# EAGLE design Vumetro (EAGLE 8.0.0)
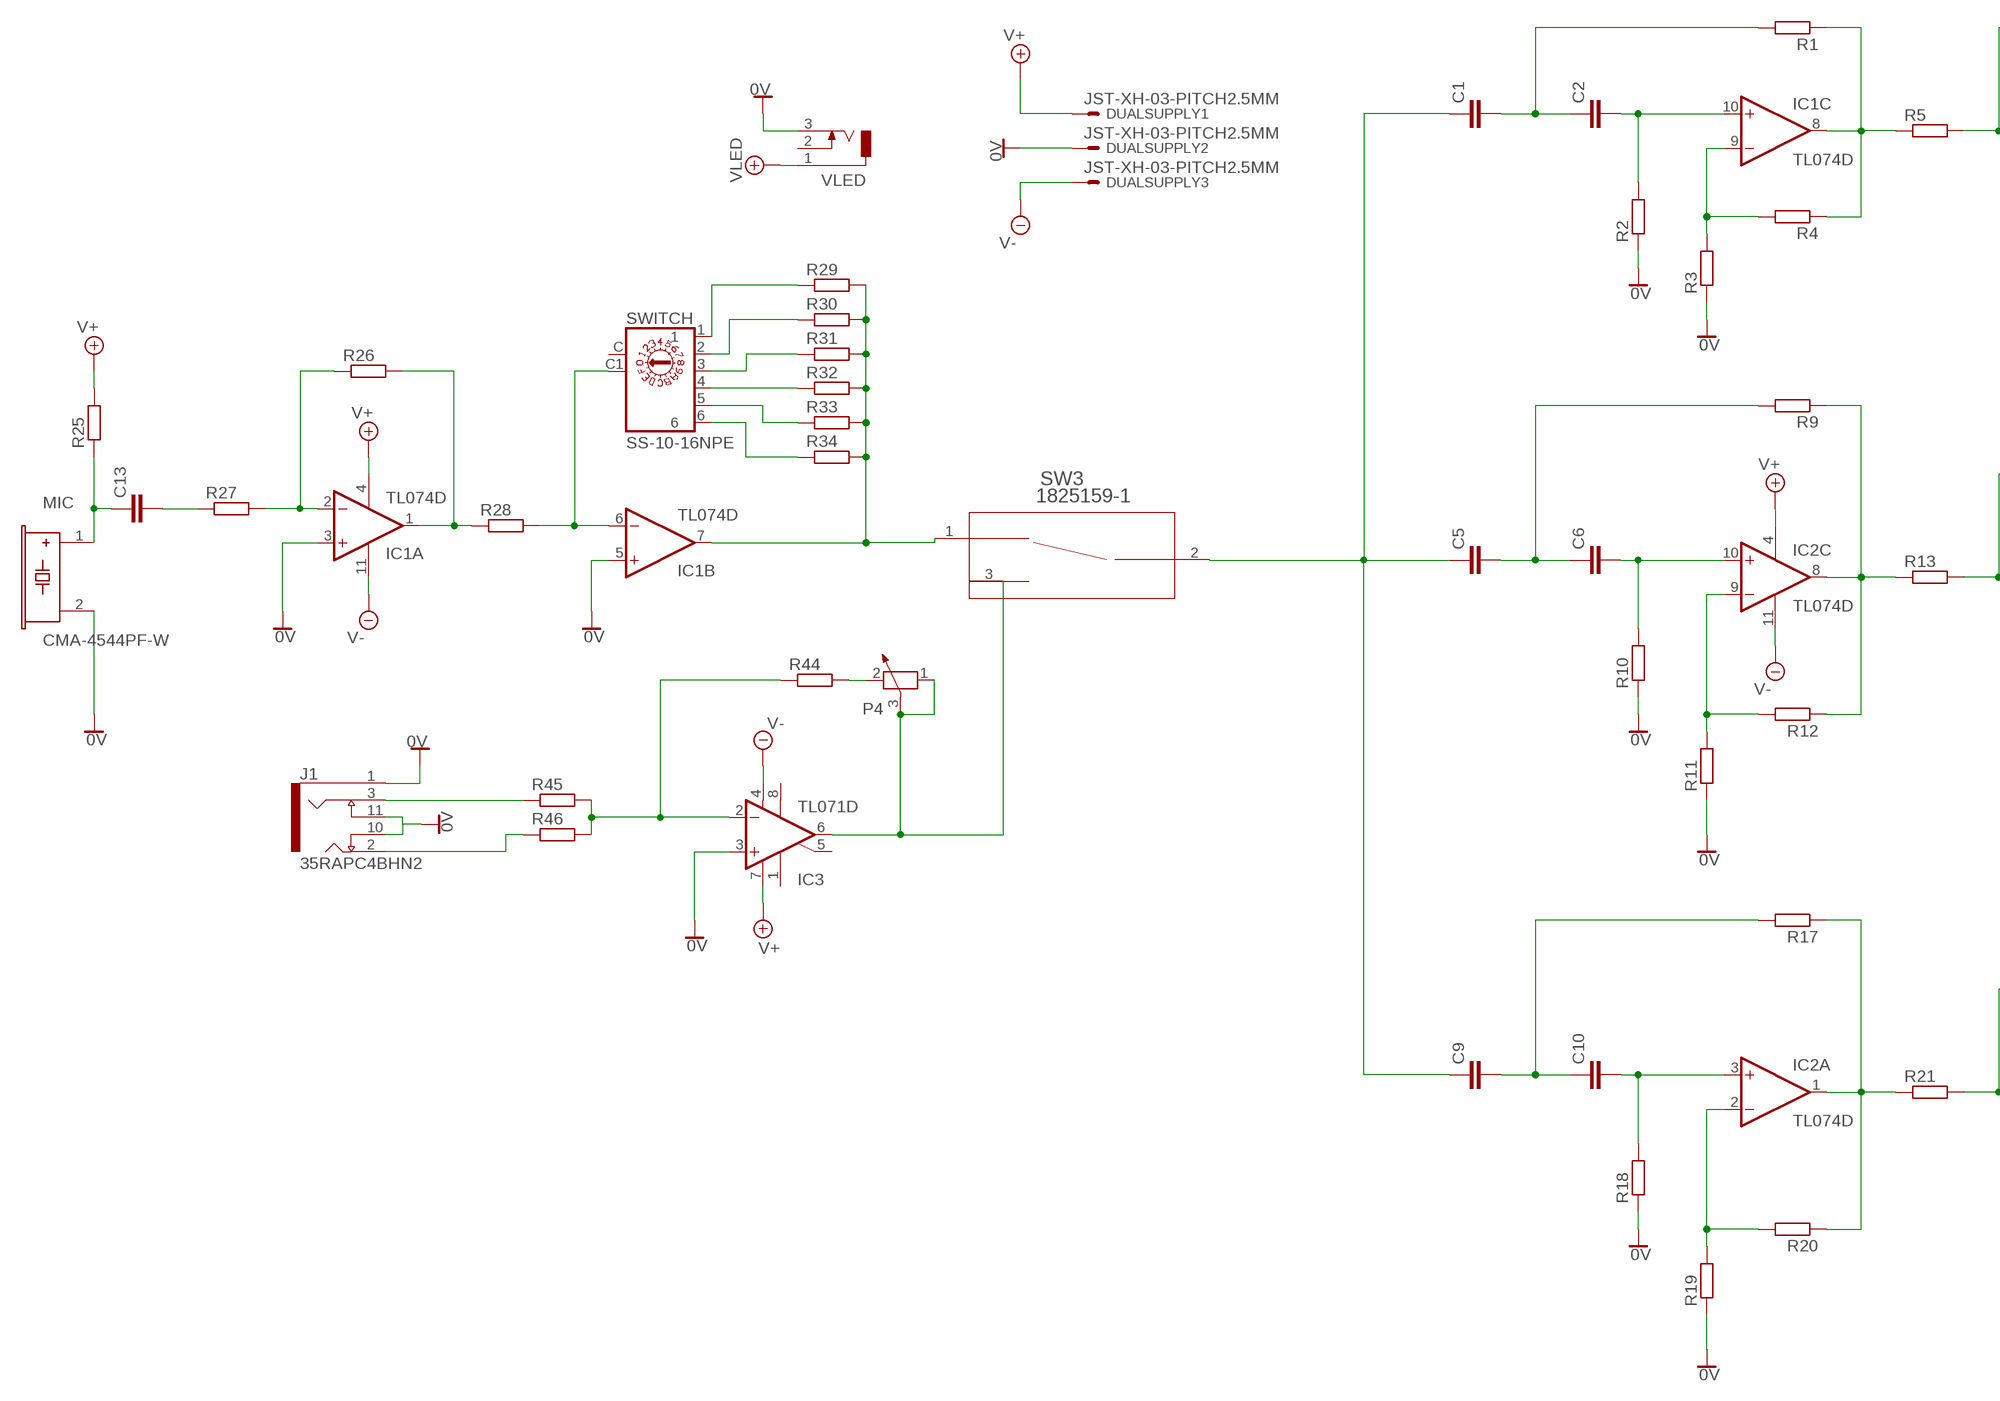
[diagram p0: schematic, sheet 1, part 1 of 2]
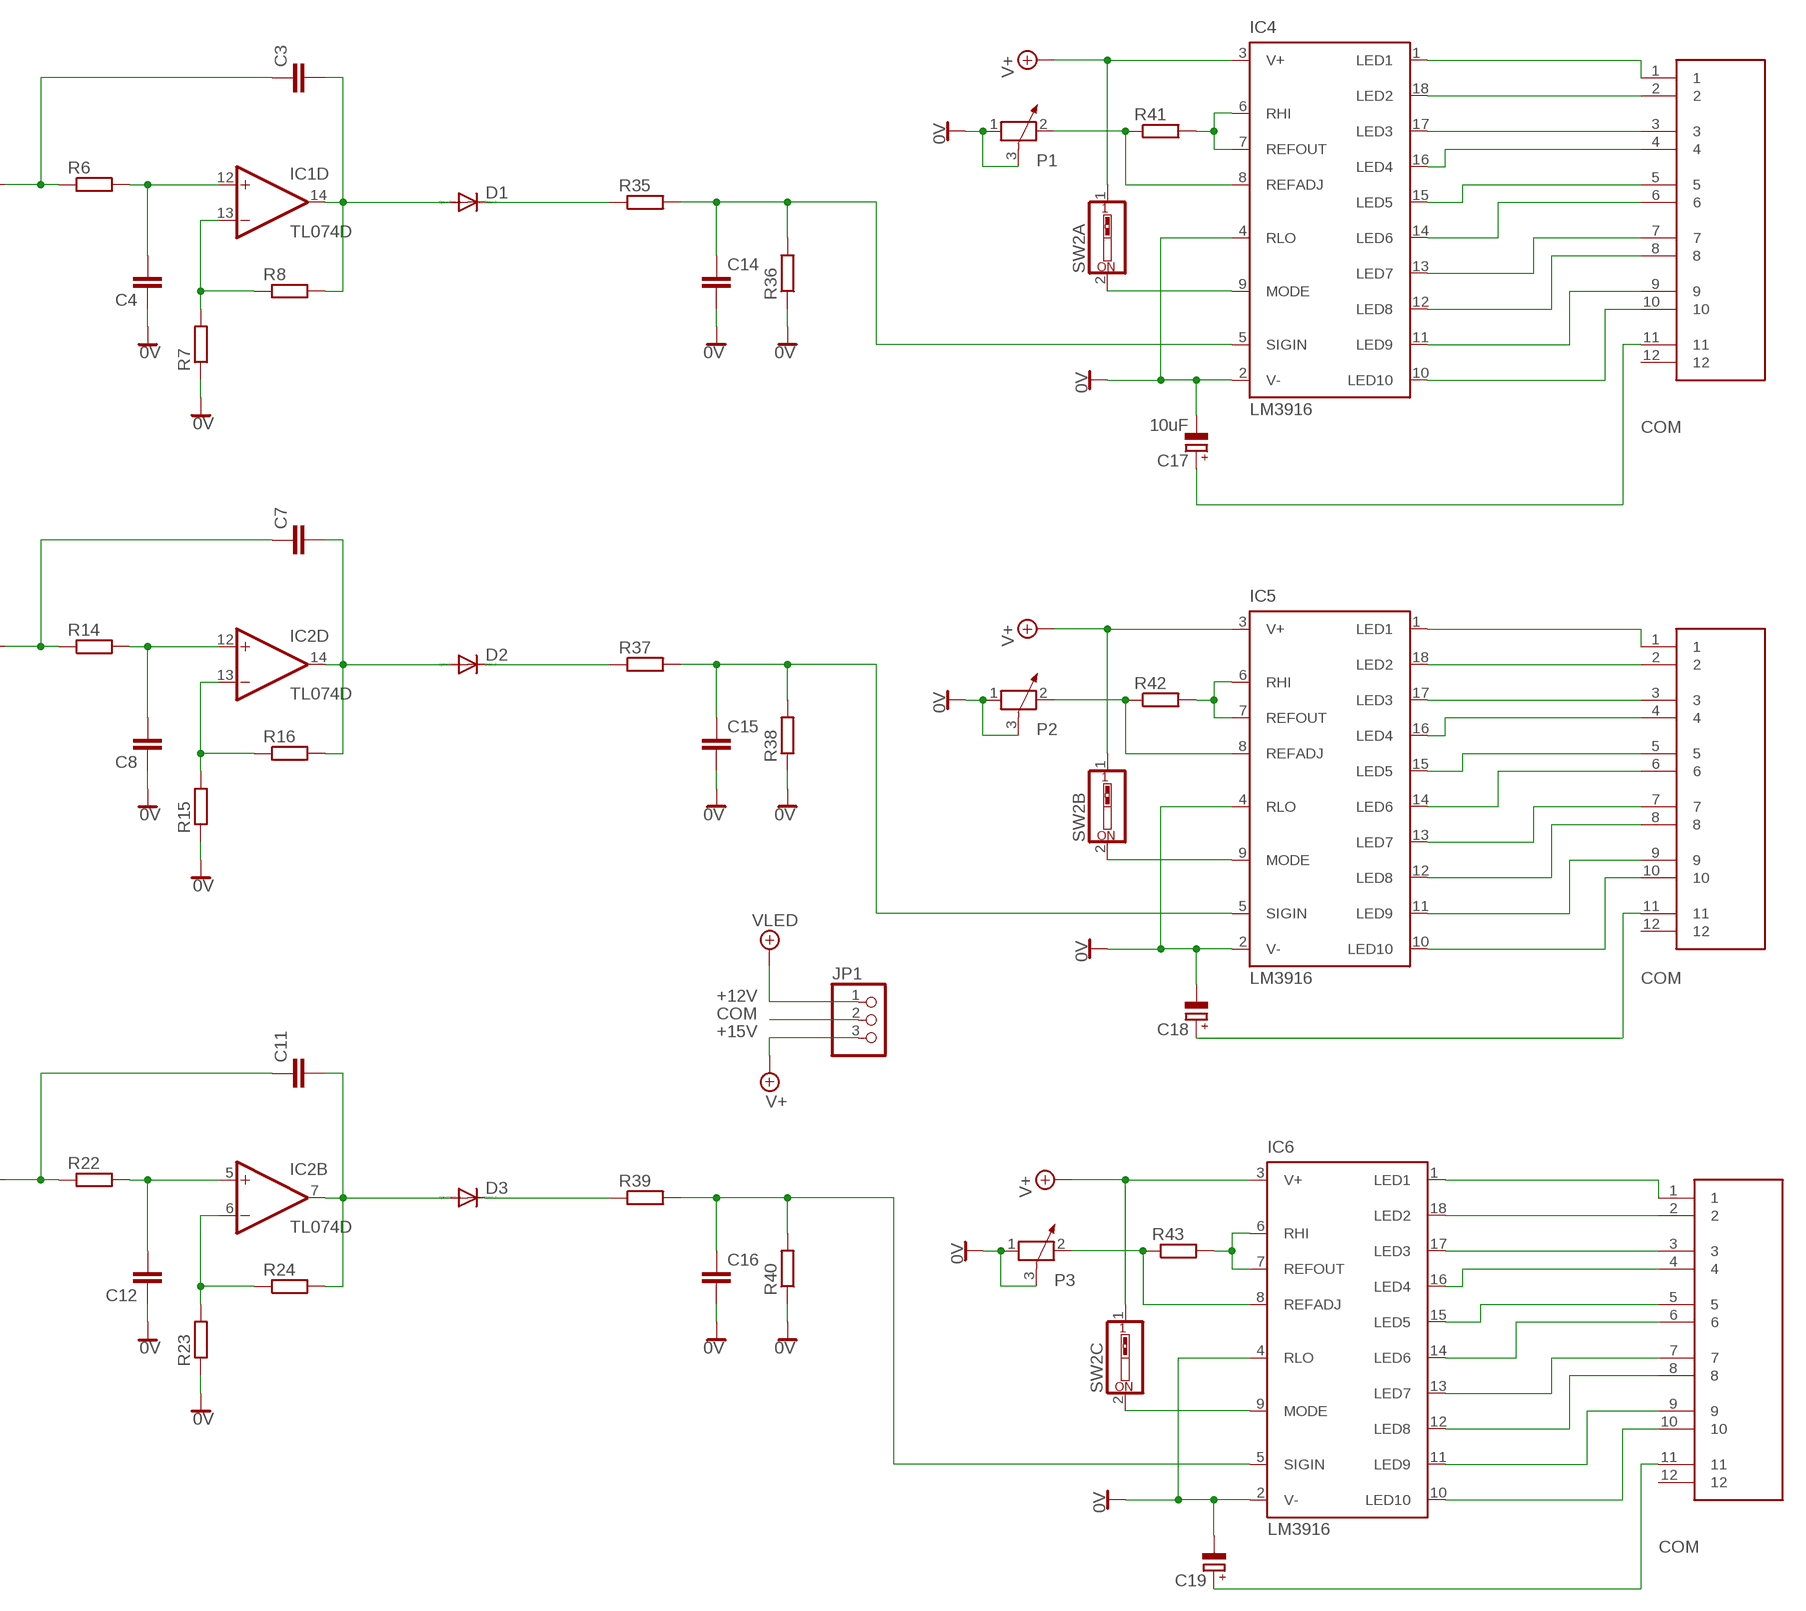
[diagram p1: schematic, sheet 1, part 2 of 2]

## Parts
C1  C-EUC2012  [C2012]
C2  C-EUC2012  [C2012]
C3  C-EUC2012  [C2012]
C4  C-EUC2012  [C2012]
C5  C-EUC2012  [C2012]
C6  C-EUC2012  [C2012]
C7  C-EUC2012  [C2012]
C8  C-EUC2012  [C2012]
C9  C-EUC2012  [C2012]
C10  C-EUC2012  [C2012]
C11  C-EUC2012  [C2012]
C12  C-EUC2012  [C2012]
C13  C-EUC2012  [C2012]
C14  C-EUC2012  [C2012]
C15  C-EUC2012  [C2012]
C16  C-EUC2012  [C2012]
C17  10uF  CPOL-EUE2-4  [E2-4]
C18  CPOL-EUE2-4  [E2-4]
C19  CPOL-EUE2-4  [E2-4]
CON1  DF11-12DP-DIL  [CON_12_2X6_DIL_DF11]
CON2  DF11-12DP-DIL  [CON_12_2X6_DIL_DF11]
CON3  DF11-12DP-DIL  [CON_12_2X6_DIL_DF11]
D1  DIODE-SOD323-W  [SOD323-W]
D2  DIODE-SOD323-W  [SOD323-W]
D3  DIODE-SOD323-W  [SOD323-W]
DUALSUPPLY  JST-XH-03-PITCH2.5MM  [JST-XH-03-PITCH2.5MM]
IC1  TL074D  [SO14]
IC2  TL074D  [SO14]
IC3  TL071D  [SO08]
IC4  LM3916  [DIL18]
IC5  LM3916  [DIL18]
IC6  LM3916  [DIL18]
J1  35RAPC4BHN2  [SWITCHCRAFT_35RAPC4BHN2]
JP1  PINHD-1X3  [1X03]
MIC  CMA-4544PF-W  [CMA-4544PF-W]
P1  POTENTIOMETER_P090  [P090]
P2  POTENTIOMETER_P090  [P090]
P3  POTENTIOMETER_P090  [P090]
P4  POTENTIOMETER_P090  [P090]
R1  R-EU_R0805  [R0805]
R2  R-EU_R0805  [R0805]
R3  R-EU_R0805  [R0805]
R4  R-EU_R0805  [R0805]
R5  R-EU_R0805  [R0805]
R6  R-EU_R0805  [R0805]
R7  R-EU_R0805  [R0805]
R8  R-EU_R0805  [R0805]
R9  R-EU_R0805  [R0805]
R10  R-EU_R0805  [R0805]
R11  R-EU_R0805  [R0805]
R12  R-EU_R0805  [R0805]
R13  R-EU_R0805  [R0805]
R14  R-EU_R0805  [R0805]
R15  R-EU_R0805  [R0805]
R16  R-EU_R0805  [R0805]
R17  R-EU_M0805  [M0805]
R18  R-EU_M0805  [M0805]
R19  R-EU_M0805  [M0805]
R20  R-EU_M0805  [M0805]
R21  R-EU_M0805  [M0805]
R22  R-EU_M0805  [M0805]
R23  R-EU_M0805  [M0805]
R24  R-EU_M0805  [M0805]
R25  R-EU_R0805  [R0805]
R26  R-EU_R0805  [R0805]
R27  R-EU_R0805  [R0805]
R28  R-EU_R0805  [R0805]
R29  R-EU_R0805  [R0805]
R30  R-EU_R0805  [R0805]
R31  R-EU_R0805  [R0805]
R32  R-EU_R0805  [R0805]
R33  R-EU_R0805  [R0805]
R34  R-EU_R0805  [R0805]
R35  R-EU_R0805  [R0805]
R36  R-EU_R0805  [R0805]
R37  R-EU_R0805  [R0805]
R38  R-EU_R0805  [R0805]
R39  R-EU_R0805  [R0805]
R40  R-EU_R0805  [R0805]
R41  R-EU_M0805  [M0805]
R42  R-EU_M0805  [M0805]
R43  R-EU_M0805  [M0805]
R44  R-EU_R0805  [R0805]
R45  R-EU_R0805  [R0805]
R46  R-EU_R0805  [R0805]
SW2A  SW_DIP-1  [EDG-01]
SW2B  SW_DIP-1  [EDG-01]
SW2C  SW_DIP-1  [EDG-01]
SW3  1825159-1  [SW3-SLIDE-2POL_P98]
SWITCH  SS-10-16NPE  [P106]
VLED  DCJ0303  [DCJ0303]

## Nets
0V: C4.1 C8.1 C12.1 C14.2 C15.2 C16.2 C17.- C18.- C19.- DUALSUPPLY.2 IC1.3(A:+IN) IC1.5(B:+IN) IC3.3(+IN) IC4.2(V-) IC4.4(RLO) IC5.2(V-) IC5.4(RLO) IC6.2(V-) IC6.4(RLO) J1.1(SLEEVE) J1.10(TSH) J1.11(RSH) MIC.2(NEG) P1.1 P1.3 P2.1 P2.3 P3.1 P3.3 R2.1 R3.1 R7.1 R10.1 R11.1 R15.1 R18.1 R19.1 R23.1 R36.1 R38.1 R40.1 VLED.3
+12V: JP1.1 VLED.1 ; supply symbol labelled VLED
+15V: DUALSUPPLY.1 IC1.4(P:V+) IC2.4(P:V+) IC3.7(V+) IC4.3(V+) IC5.3(V+) IC6.3(V+) JP1.3 R25.2 SW2A.1 SW2B.1 SW2C.1 ; supply symbol labelled V+
-15V: DUALSUPPLY.3 IC1.11(P:V-) IC2.11(P:V-) IC3.4(V-) ; supply symbol labelled V-
COM: C17.+ C18.+ C19.+ CON1.11 CON2.11 CON3.11 JP1.2
N$1: IC1.7(B:OUT) R29.2 R30.2 R31.2 R32.2 R33.2 R34.2 SW3.1
N$2: R29.1 SWITCH.1
N$3: R30.1 SWITCH.2
N$4: R31.1 SWITCH.3
N$5: R32.1 SWITCH.4
N$6: R33.1 SWITCH.5
N$7: R34.1 SWITCH.6
N$8: IC1.2(A:-IN) R26.1 R27.2
N$9: IC1.6(B:-IN) R28.2 SWITCH.C1
N$10: IC1.1(A:OUT) R26.2 R28.1
N$11: IC3.2(-IN) R44.1 R45.2 R46.2
N$12: P4.2 R44.2
N$13: IC3.6(OUT) P4.1 P4.3 SW3.3
N$14: J1.3(RING) R45.1
N$15: J1.2(TIP) R46.1
N$16: C1.2 C2.1 R1.2
N$17: C2.2 IC1.10(C:+IN) R2.2
N$18: IC1.9(C:-IN) R3.2 R4.2
N$19: IC1.8(C:OUT) R1.1 R4.1 R5.1
N$20: IC1.13(D:-IN) R7.2 R8.1
N$21: C3.2 D1.A IC1.14(D:OUT) R8.2
N$22: C4.2 IC1.12(D:+IN) R6.2
N$23: C3.1 R5.2 R6.1
N$24: C5.2 C6.1 R9.2
N$25: C6.2 IC2.10(C:+IN) R10.2
N$26: IC2.9(C:-IN) R11.2 R12.2
N$27: IC2.8(C:OUT) R9.1 R12.1 R13.1
N$28: IC2.13(D:-IN) R15.2 R16.1
N$29: C7.2 D2.A IC2.14(D:OUT) R16.2
N$30: C8.2 IC2.12(D:+IN) R14.2
N$31: C7.1 R13.2 R14.1
N$32: C9.2 C10.1 R17.2
N$33: C10.2 IC2.3(A:+IN) R18.2
N$34: IC2.2(A:-IN) R19.2 R20.2
N$35: IC2.1(A:OUT) R17.1 R20.1 R21.1
N$36: IC2.6(B:-IN) R23.2 R24.1
N$37: C11.2 D3.A IC2.7(B:OUT) R24.2
N$38: C12.2 IC2.5(B:+IN) R22.2
N$39: C11.1 R21.2 R22.1
N$40: C1.1 C5.1 C9.1 SW3.2
N$41: D1.C R35.1
N$42: C14.1 IC4.5(SIGIN) R35.2 R36.2
N$43: D2.C R37.1
N$44: C15.1 IC5.5(SIGIN) R37.2 R38.2
N$45: D3.C R39.1
N$46: C16.1 IC6.5(SIGIN) R39.2 R40.2
N$47: C13.2 R27.1
N$48: IC4.9(MODE) SW2A.2
N$49: IC4.6(RHI) IC4.7(REFOUT) R41.2
N$50: IC4.8(REFADJ) P1.2 R41.1
N$51: C13.1 MIC.1(POS) R25.1
N$52: CON1.1 IC4.1(LED1)
N$53: CON1.2 IC4.18(LED2)
N$54: CON1.3 IC4.17(LED3)
N$55: CON1.4 IC4.16(LED4)
N$56: CON1.5 IC4.15(LED5)
N$57: CON1.6 IC4.14(LED6)
N$58: CON1.7 IC4.13(LED7)
N$59: CON1.8 IC4.12(LED8)
N$60: CON1.9 IC4.11(LED9)
N$61: CON1.10 IC4.10(LED10)
N$63: IC5.9(MODE) SW2B.2
N$64: IC5.6(RHI) IC5.7(REFOUT) R42.2
N$65: IC5.8(REFADJ) P2.2 R42.1
N$66: CON2.1 IC5.1(LED1)
N$67: CON2.2 IC5.18(LED2)
N$68: CON2.3 IC5.17(LED3)
N$69: CON2.4 IC5.16(LED4)
N$70: CON2.5 IC5.15(LED5)
N$71: CON2.6 IC5.14(LED6)
N$72: CON2.7 IC5.13(LED7)
N$73: CON2.8 IC5.12(LED8)
N$74: CON2.9 IC5.11(LED9)
N$75: CON2.10 IC5.10(LED10)
N$77: IC6.9(MODE) SW2C.2
N$78: IC6.6(RHI) IC6.7(REFOUT) R43.2
N$79: IC6.8(REFADJ) P3.2 R43.1
N$80: CON3.1 IC6.1(LED1)
N$81: CON3.2 IC6.18(LED2)
N$82: CON3.3 IC6.17(LED3)
N$83: CON3.4 IC6.16(LED4)
N$84: CON3.5 IC6.15(LED5)
N$85: CON3.6 IC6.14(LED6)
N$86: CON3.7 IC6.13(LED7)
N$87: CON3.8 IC6.12(LED8)
N$88: CON3.9 IC6.11(LED9)
N$89: CON3.10 IC6.10(LED10)
Unconnected: CON1.12 CON2.12 CON3.12 IC3.1(ON1) IC3.5(ON2) IC3.8(OPT) SWITCH.C VLED.2

## Library data of the parts
C1-C16 = rcl:C-EU: CAPACITOR, European symbol
C17-C19 = rcl:CPOL-EU: POLARIZED CAPACITOR, European symbol
CON1-CON3 = con-hirose:DF11-12DP-DIL
D1-D3 = diode:DIODE-: DIODE
DUALSUPPLY = Rembrandt Electronics - JST XH Connectors v1-0:JST-XH-03-PITCH2.5MM
IC1 IC2 = linear:TL074: OP AMP
IC3 = linear:TL071: OP AMP
IC4-IC6 = national-semiconductor:LM3916
J1 = mini jack:35RAPC4BHN2: Conn 3.5MM Stereo Jack F 5 POS Solder RA Thru-Hole 5 Terminal 1 Port; DESCRIPTION: Conn 3.5MM Stereo Jack F 5 POS Solder RA Thru-Hole 5 Terminal 1 Port; DIGI-KEY_PART_NUMBER: SC1459-ND; DIGI-KEY_PURCHASE_URL: https://www.digikey.es/product-detail/en/switchcraft-inc/35RAPC4BHN2/SC1459-ND/1288690?WT.z_cid=ref_snapeda&utm_source=snapeda&utm_medium=aggregator&utm_campaign=buynow; MF: Switchcraft; MP: 35RAPC4BHN2; PACKAGE: None
JP1 = pinhead:PINHD-1X3: PIN HEADER
MIC = Electret:CMA-4544PF-W; DESCRIPTION: CMA Series 9.7 mm Electret Condenser Omni-Directional Pin Mount 3 V Microphone; DIGI-KEY_PART_NUMBER: 102-1721-ND; DIGI-KEY_PURCHASE_URL: https://www.digikey.es/product-detail/en/cui-inc/CMA-4544PF-W/102-1721-ND/1869981?WT.z_cid=ref_snapeda&utm_source=snapeda&utm_medium=aggregator&utm_campaign=buynow; MF: CUI; MP: CMA-4544PF-W; PACKAGE: 6-DIP-6 CUI
P1-P4 = rcl:POTENTIOMETER_: Potentiometer
R1-R46 = rcl:R-EU_: RESISTOR, European symbol
SW2A SW2B SW2C = special:SW_DIP-1: DIP SWITCH
SW3 = switch:1825159-1; MANUFACTURER_PART_NUMBER: 18251591; VENDOR: TE Connectivity
SWITCH = switch-dil:SS-10-16NPE
VLED = con-jack:DCJ0303: DC POWER JACK Source: DCJ0303.pdf; OC_FARNELL: unknown; OC_NEWARK: unknown

## Board
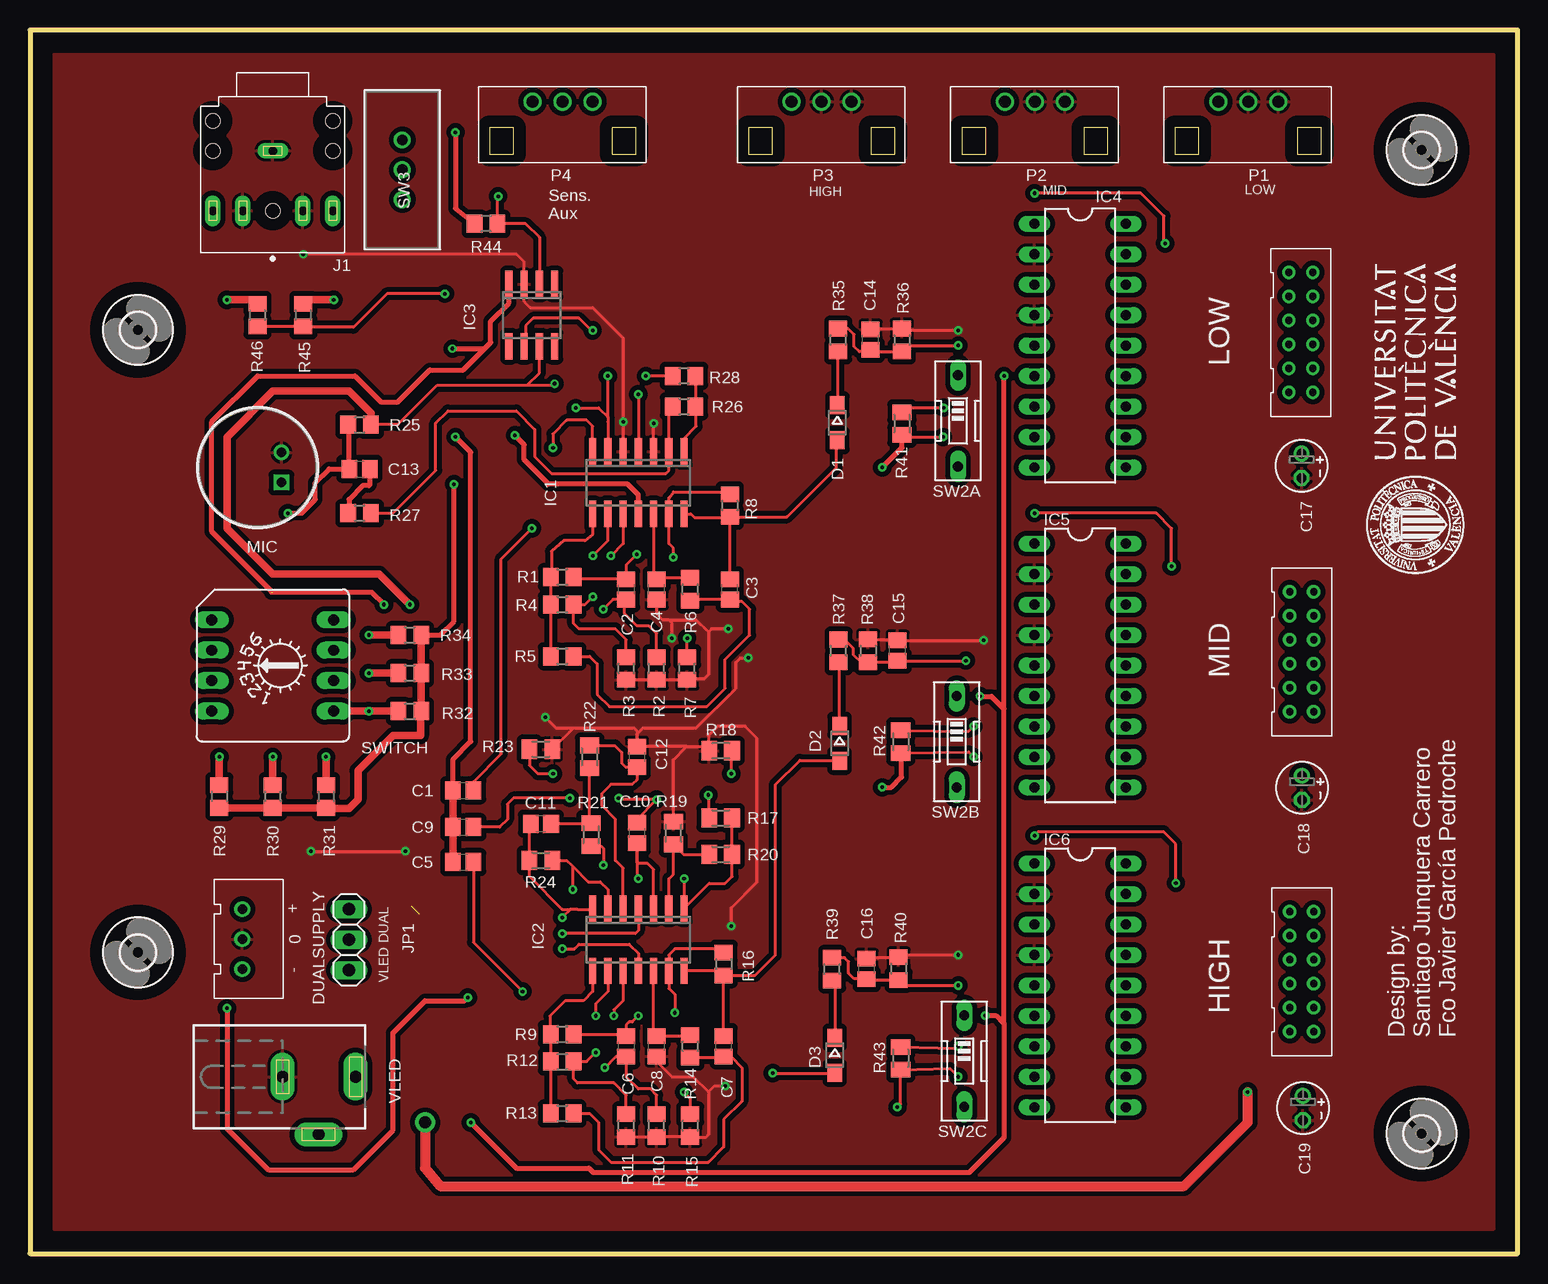
[diagram p2: board, top side]
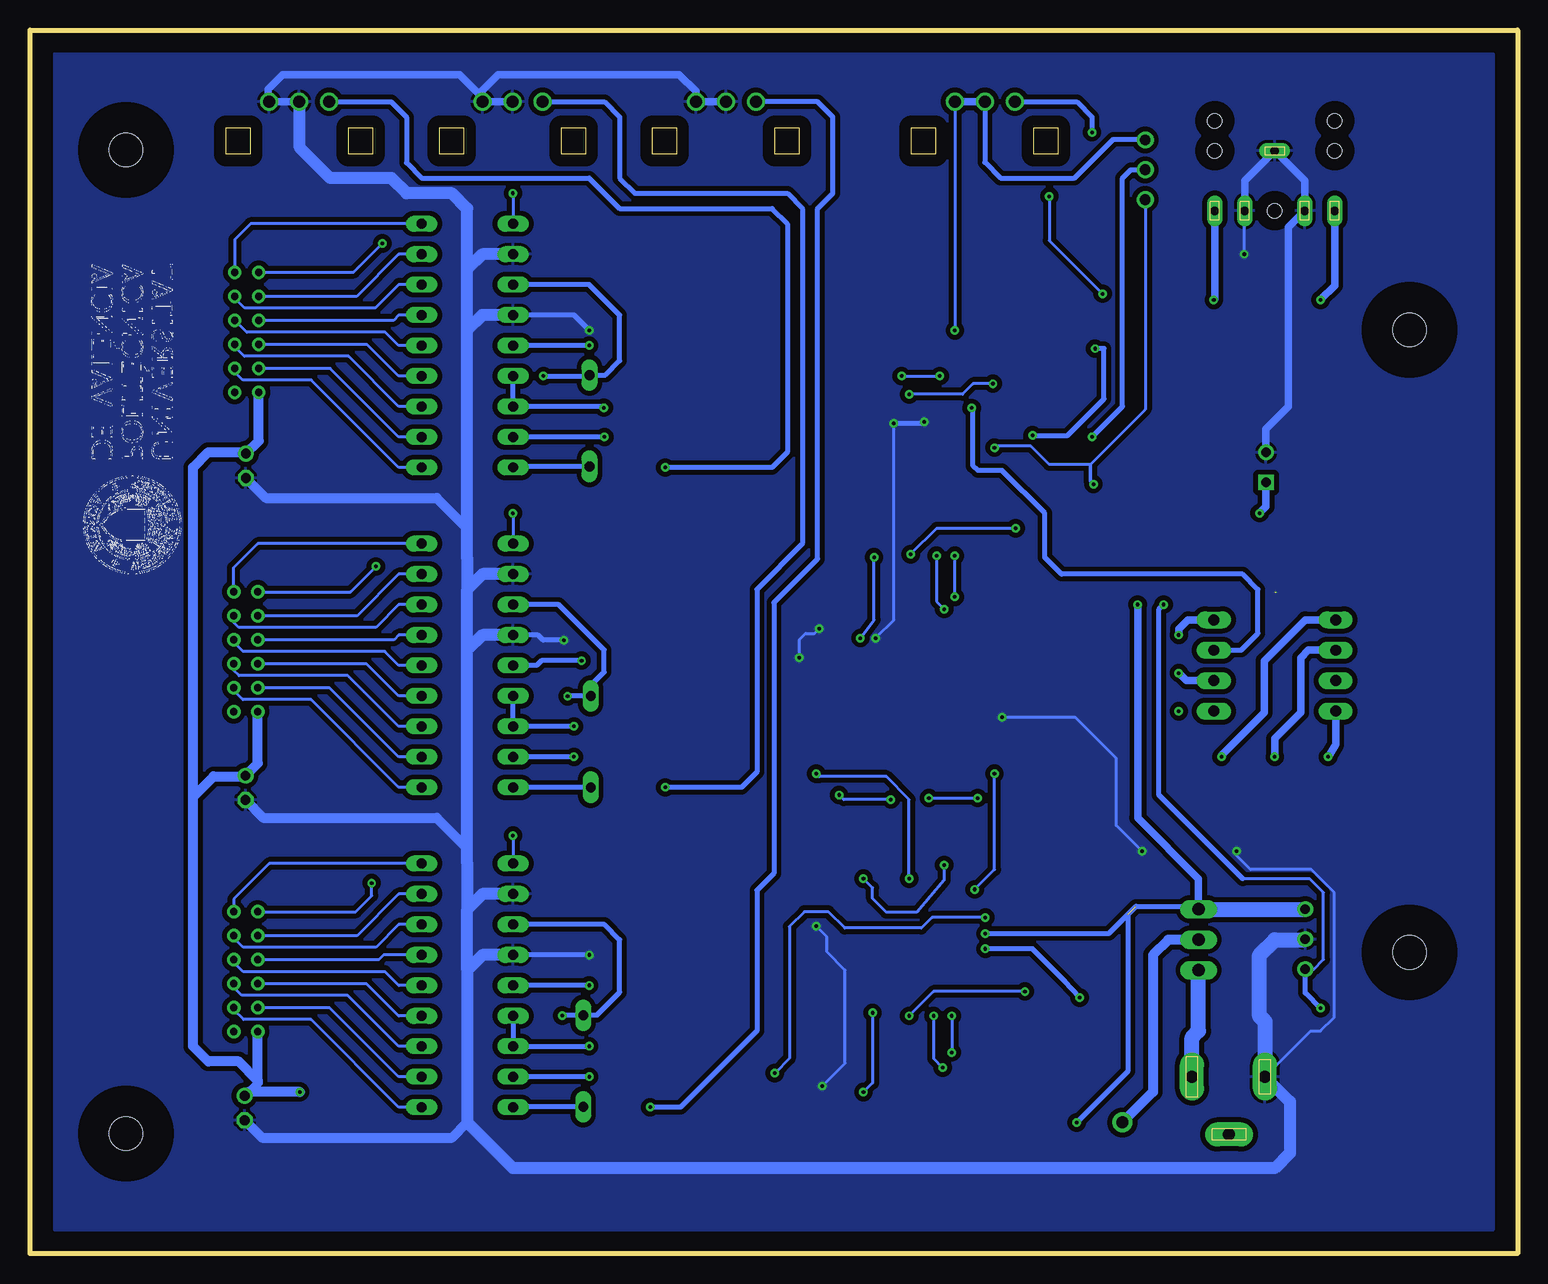
[diagram p3: board, bottom side, seen from below]

Size 124 x 102 mm. Coordinates in mm from the lower left corner, seen from the top.
Outline: 0,0 124,0 124,102 0,102 0,0
Copper layers (1*16): Top 0.035mm / dielectric 1.5mm / Bottom 0.035mm
Design rules "default *": minimum track width 6mil, minimum drill 0.3mm, track to track 6mil, track to pad 6mil, pad to pad 6mil, via to via 6mil, smd to smd 4mil, copper to edge 40mil, drill to drill 8mil, minimum pad ring 10mil, minimum via ring 8mil, stop-mask expansion 4mil, vias tented up to drill 0mil, thermal gap 10mil

### Footprints (pad centres in the part's own frame; a part is rotated, then mirrored left to right if it is on the bottom)
C2012 = smd 1.3 x 1.5: 1 -0.85,0; 2 0.85,0
E2-4 = drill 0.813 pad 1.27: + -1.016,0 | drill 0.813 pad 1.27 octagon: - 1.016,0
CON_12_2X6_DIL_DF11 = drill 0.6: 1 -4.953,-1.016; 2 -4.953,0.984; 3 -2.953,-1.016; 4 -2.953,0.984; 5 -0.953,-1.016; 6 -0.953,0.984; 7 1.047,-1.016; 8 1.047,0.984; 9 3.047,-1.016; 10 3.047,0.984; 11 5.047,-1.016; 12 5.047,0.984
SOD323-W = smd 1.5 x 1.2: A 1.45,0; C -1.45,0
JST-XH-03-PITCH2.5MM = drill 0.8: 1 -2.54,-1.27; 2 -0.04,-1.27; 3 2.46,-1.27
SO14 = smd 0.6 x 2.2: 1 -3.81,-2.6; 2 -2.54,-2.6; 3 -1.27,-2.6; 4 0,-2.6; 5 1.27,-2.6; 6 2.54,-2.6; 7 3.81,-2.6; 8 3.81,2.6; 9 2.54,2.6; 10 1.27,2.6; 11 0,2.6; 12 -1.27,2.6; 13 -2.54,2.6; 14 -3.81,2.6
SO08 = smd 0.6 x 2.2: 1 -1.905,-2.6; 2 -0.635,-2.6; 3 0.635,-2.6; 4 1.905,-2.6; 5 1.905,2.6; 6 0.635,2.6; 7 -0.635,2.6; 8 -1.905,2.6
DIL18 = drill 0.813 long: 1 -10.16,-3.81; 2 -7.62,-3.81; 3 -5.08,-3.81; 4 -2.54,-3.81; 5 0,-3.81; 6 2.54,-3.81; 7 5.08,-3.81; 8 7.62,-3.81; 9 10.16,-3.81; 10 10.16,3.81; 11 7.62,3.81; 12 5.08,3.81; 13 2.54,3.81; 14 0,3.81; 15 -2.54,3.81; 16 -5.08,3.81; 17 -7.62,3.81; 18 -10.16,3.81
SWITCHCRAFT_35RAPC4BHN2 = drill 0.7 pad 1.3 long: 1 0,-1; 2 5,4; 3 -5,4; 10 2.5,4; 11 -2.5,4 | hole 1.2: 0,4; -5,-1; -5,-3.5; 5,-1; 5,-3.5
1X03 = drill 1.016 long: 1 -2.54,0; 2 0,0; 3 2.54,0
CMA-4544PF-W = drill 0.8 square: 1 2,-1.25 | drill 0.8: 2 2,1.25
P090 = drill 1: 1 0,0; 2 5,0; 3 2.5,0
R0805 = smd 1.3 x 1.5: 1 -0.95,0; 2 0.95,0
M0805 = smd 1.3 x 1.6: 1 -0.95,0; 2 0.95,0
EDG-01 = drill 0.813 long: 1 0,-3.81; 2 0,3.81
SW3-SLIDE-2POL_P98 = drill 0.889 pad 1.397: 1 -4.978,0; 2 -2.489,0; 3 0,0
P106 = drill 0.914 long: 1 6.35,5.08; 2 6.35,0; 3 6.35,-2.54; 4 -3.81,5.08; 5 -3.81,2.54; 6 -3.81,-2.54; C 6.35,2.54; C1 -3.81,0
2,8 = hole 2.8: 0,0
DCJ0303 = drill 1 pad 2 long: 1 0,3.1; 2 4.8,0; 3 0,-3

### Placement (x,y rotation side)
C1  36.11,38.61 0 top
C2  49.7,55.37 270 top
C3  58.33,55.37 90 top
C4  52.24,55.37 90 top
C5  36.11,32.64 0 top
C6  49.7,17.27 270 top
C7  57.83,17.27 90 top
C8  52.24,17.27 90 top
C9  36.11,35.56 0 top
C10  50.59,35.05 270 top
C11  42.59,35.81 180 top
C12  50.59,41.4 270 top
C13  27.47,65.4 0 top
C14  70.07,76.18 90 top
C15  72.31,50.26 90 top
C16  69.74,23.72 90 top
C17  106,65.66 270 top
C18  106.03,38.82 270 top
C19  106.11,12.13 270 top
CON1  105.95,76.84 270 top
CON2  106.02,50.21 270 top
CON3  106.02,23.54 270 top
D1  67.3,69.26 270 top
D2  67.49,42.53 270 top
D3  67.08,16.53 270 top
DUALSUPPLY  18.96,26.16 270 top
IC1  50.71,64.26 180 top
IC2  50.71,26.16 180 top
IC3  41.82,78.23 180 top
IC4  87.54,75.69 270 top
IC5  87.54,49.02 270 top
IC6  87.54,22.35 270 top
J1  20.23,90.93 180 top
JP1  26.58,26.16 90 top
MIC  18.96,65.53 0 top
P1  104.05,96.01 180 top
P2  86.27,96.01 180 top
P3  68.49,96.01 180 top
P4  46.9,96.01 180 top
R1  44.36,56.39 0 top
R2  52.24,48.77 90 top
R3  49.7,48.77 90 top
R4  44.36,54.1 0 top
R5  44.36,49.78 0 top
R6  55.03,55.37 90 top
R7  54.78,48.77 90 top
R8  58.33,62.36 270 top
R9  44.36,18.29 0 top
R10  52.24,10.67 90 top
R11  49.7,10.67 90 top
R12  44.36,16 0 top
R13  44.36,11.68 0 top
R14  55.03,17.27 90 top
R15  55.03,10.67 90 top
R16  57.83,24.13 270 top
R17  57.57,36.32 180 top
R18  57.57,41.91 0 top
R19  53.64,35.05 270 top
R20  57.57,33.27 180 top
R21  46.78,34.92 90 top
R22  46.65,41.4 90 top
R23  42.59,42.04 180 top
R24  42.59,32.77 180 top
R25  27.47,69.09 0 top
R26  54.52,70.61 0 top
R27  27.47,61.72 0 top
R28  54.52,73.15 180 top
R29  15.79,38.1 270 top
R30  20.23,38.1 270 top
R31  24.68,38.1 270 top
R32  31.66,45.21 0 top
R33  31.66,48.39 0 top
R34  31.66,51.56 0 top
R35  67.37,76.15 90 top
R36  72.68,76.15 270 top
R37  67.4,50.24 90 top
R38  69.87,50.25 270 top
R39  66.86,23.71 90 top
R40  72.41,23.75 270 top
R41  72.69,69.19 90 top
R42  72.58,42.67 90 top
R43  72.58,16.27 90 top
R44  38.01,85.85 180 top
R45  22.77,78.23 270 top
R46  18.96,78.23 270 top
SW2A  77.36,69.42 180 top
SW2B  77.26,42.67 180 top
SW2C  77.88,16.05 180 top
SW3  31.03,92.84 90 top
SWITCH  21.5,50.29 180 top
U$1  [LOGOUPVTOP]  120.86,54.33 90 top
U$4  [2,8]  9,77 0 top
U$5  [2,8]  116,92 0 top
U$6  [2,8]  116,10 0 top
U$7  [2,8]  9,25.1 0 top
VLED  24.04,14.73 270 top

### Tracks (layer width: path | path; a pad name or v marks a point on that pad's centre or on a via)
0V  (via drill 0.3 pad 0.51)
  Top 0.254: R11.1 R10.1 R15.1 55.1,9.65 56.3,9.65 56.56,9.91 56.56,13.46 | C8.1 52.24,16 53.51,14.73 55.29,14.73 56.56,13.46 | R3.1 R2.1 R7.1 54.84,47.88 56.18,47.88 56.56,48.26 56.56,51.82 | 52.24,54.1 C4.1 52.24,53.34 52.75,52.83 53.25,52.83 | 53.25,52.83 55.54,52.83 56.56,51.82 | R23.1 45.31,43.81 | 45.31,43.81 50.33,43.81 50.59,43.56 C12.1 | R18.1 56.28,42.25 54.74,42.25 | 54.74,42.25 C12.1 | R19.1 53.64,41.15 54.74,42.25 | IC1.5 v49.44,69.34 49.44,76.33 46.91,78.87 41.7,78.87 41.19,79.38 IC3.3 41.19,82.68 40.55,83.31 v22.77,83.31 | IC1.3 v51.98,69.22 | v53.51,51.31 53.51,52.58 53.25,52.83 | C12.1 50.59,43.31 51.1,43.81 55.54,43.81 58.84,47.12 58.84,49.28 59.22,49.66 v59.86,49.66 | v58.21,52.07 56.81,52.07 56.56,51.82 | v23.41,33.53 v31.28,33.53 | v42.97,44.7 43.86,43.81 45.31,43.81 | 56.56,13.46 57.06,13.97 v57.95,13.97 | v58.46,27.3 58.46,28.83 60.62,30.99 60.62,42.93 59.61,43.94 57.32,43.94 56.56,43.18 56.56,41.98 R18.1 | R18.1 56.62,41.84 57.06,41.4 | R38.1 72.23,51.2 C15.2 79.47,51.11 v79.49,51.13 | C14.2 70.14,77.1 R36.1 72.82,76.96 v77.39,76.96 | C16.2 69.87,24.7 R40.1 72.6,24.89 v77.39,24.89
  Bottom 0.254: v22.77,83.31 22.77,86.89 J1.11 | v53.51,51.31 51.98,52.83 v51.98,69.22 | v59.86,49.66 59.86,51.18 59.35,51.69 58.59,51.69 v58.21,52.07 | VLED.3 17.23,18.54 16.42,18.54 15.28,19.68 15.28,30.1 17.19,32 22.27,32 23.41,33.15 v23.41,33.53 | v31.28,33.53 33.44,35.69 33.44,41.27 36.87,44.7 v42.97,44.7 | v57.95,13.97 56.05,15.88 56.05,23.62 57.57,25.15 57.57,26.42 v58.46,27.3
  Bottom 0.406: v51.98,69.22 49.57,69.22 v49.44,69.34 | v79.49,51.13 81.22,51.13 81.65,51.56 IC5.4 | v77.39,76.96 78.66,78.23 IC4.4 | v77.39,24.89 IC6.4
  Bottom 0.61: J1.11 22.73,89.43 J1.1 17.73,89.43 J1.10 19.09,85.58 19.09,70.61 20.97,68.74 MIC.2 | P3.3 P3.1 68.5,96.88 69.89,98.27 84.98,98.27 86.3,96.95 86.3,96.04 P2.1 | P2.3 P2.1 | P1.3 P1.1 104.13,96.09 104.13,97.08 102.94,98.27 88.2,98.27 86.28,96.34 P2.1
  Bottom 0.813: C19.- 104.65,9.65 88.81,9.65 87.55,10.92 | C18.- 104.55,36.32 90.08,36.32 87.55,33.78 87.55,32.51 | C17.- 104.34,62.99 90.08,62.99 87.55,60.45 87.55,57.91
  Bottom 1.016: VLED.3 18.97,12.65 18.97,8.38 20.23,7.11 83.73,7.11 87.55,10.92 87.55,23.62 | 87.55,76.96 87.55,82.04 | 87.55,55.37 87.55,57.91 87.55,76.96 | 87.55,50.29 87.55,55.37 | 87.55,28.7 87.55,32.51 87.55,50.29 | 87.55,23.62 87.55,28.7 | 87.55,82.04 87.55,87.12 88.81,88.39 92.62,88.39 93.89,89.66 98.97,89.66 101.52,92.2 101.52,95.97 P1.3 | IC4.2 86.28,83.31 87.55,82.04 | IC4.4 86.28,78.23 87.55,76.96 | IC5.2 86.28,56.64 87.55,55.37 | IC5.4 86.28,51.56 87.55,50.29 | IC6.2 86.28,29.97 87.55,28.7 | IC6.4 86.28,24.89 87.55,23.62
  Bottom 1.27: VLED.3 21.05,19.35 21.51,19.81 21.51,24.89 20.23,26.16 17.73,26.16 DUALSUPPLY.2
  pour Top (isolate 0.406): 2,2 2,100 122,100 122,2
  pour Bottom (isolate 0.406): 2,2 2,100 122,100 122,2
+12V
  Bottom 1.27: VLED.1 27.15,17.98 26.59,18.54 JP1.1
+15V  (via drill 0.3 pad 0.51)  (1 unrouted)
  Top 0.254: IC2.4 50.72,26.92 50.46,26.67 v44.37,26.67 | R25.2 30.65,69.09 33.95,72.39 41.44,72.39 | 41.44,72.39 42.46,73.41 IC3.7 | 41.44,72.39 43.6,72.39 v43.73,72.52 | v50.72,71.63 IC1.4
  Top 0.406: v36.74,10.92 40.55,7.11 46.6,7.11 46.96,6.76 78.3,6.76 81.19,9.65 81.19,19.15 | 81.19,19.15 81.19,45.41 | 81.19,45.41 v81.19,73.15 | v79.19,46.46 80.15,46.46 81.19,45.41 | v79.62,19.84 80.51,19.84 81.19,19.15
  Top 0.61: R25.2 28.42,70.04 26.59,71.88 20.23,71.88 16.42,68.07 16.42,60.45 20.23,56.64 29.12,56.64 v31.66,54.1
  Bottom 0.254: v43.73,72.52 45.38,72.52 46.27,71.63 v50.72,71.63 | 77.26,47.35 SW2B.1
  Bottom 0.406: v44.37,26.67 34.08,26.67 31.79,28.96 26.84,28.96 JP1.3 | 77.26,47.35 76.14,48.46 76.14,50.32 79.92,54.1 IC5.3 | IC4.3 77.39,80.77 74.84,78.23 74.84,74.42 76.04,73.23 SW2A.1 77.44,73.15 v81.19,73.15 | IC6.3 76.11,27.43 74.84,26.16 74.84,21.77 76.77,19.86 SW2C.1 79.6,19.86 v79.62,19.84 | 32.49,28.26 32.49,15.18 v36.74,10.92 | v79.19,46.46 79.16,46.48 SW2B.1
  Bottom 0.61: v31.66,54.1 31.66,36.32 26.59,31.24 JP1.3
  Bottom 1.27: JP1.3 DUALSUPPLY.1
-15V  (via drill 0.3 pad 0.51)  (1 unrouted)
  Top 0.254: v44.37,25.4 45.38,25.4 45.76,25.78 49.95,25.78 50.72,25.02 IC2.11
  Top 0.406: v16.42,20.45 16.42,10.41 19.85,6.99 26.97,6.99 30.27,10.29 30.27,18.41 32.94,21.08 36.24,21.08 v36.49,21.34 36.62,21.21 | v29.51,54.1 28.49,55.12 20.11,55.12 | 20.23,55.12 15.16,60.2 15.16,69.34 18.97,73.15 27.09,73.15 29.25,70.99 30.65,70.99 33.32,73.66 36.11,73.66 37.89,75.44 | IC3.4 39.92,79.25 38.4,77.72 38.4,75.95 37.89,75.44 | IC1.11 50.72,63.25 49.83,64.14 43.22,64.14 41.19,66.17 41.19,67.44 v40.43,68.2 | v35.22,75.44 37.89,75.44
  Bottom 0.254: DUALSUPPLY.3 16.98,23.7 16.17,24.51 16.17,30.1 17.31,31.24 22.9,31.24
  Bottom 0.406: DUALSUPPLY.3 17.7,21.72 v16.42,20.45 | v36.49,21.34 37.76,22.73 40.43,25.4 v44.37,25.4 | 22.9,31.24 29.89,38.23 29.89,53.72 v29.51,54.1 | v40.43,68.2 37.51,68.2 34.46,71.25 34.46,75.44 v35.22,75.44
COM  (via drill 0.3 pad 0.51, 1 pad 1.68)
  Top 0.813: v32.94,10.92 32.94,7.11 34.2,5.61 96.21,5.61 101.52,10.92 v101.52,13.46
  Bottom 0.61: 105.79,13.46 C19.+ 105.01,14.25 105.01,14.42
  Bottom 0.813: JP1.2 29.12,26.16 30.4,24.89 30.4,13.46 v32.94,10.92 | v101.52,13.46 105.79,13.46 | 105.01,14.25 CON3.11 | 105.01,14.42 106.59,16 109.14,16 110.41,17.27 110.41,36.32 110.41,38.08 | 110.41,38.08 110.41,65.53 109.14,66.8 106.12,66.8 C17.+ 104.93,67.75 CON1.11 | 110.41,38.08 108.7,39.78 106.1,39.78 C18.+ 105.01,40.86 CON2.11
N$1  (via drill 0.3 pad 0.51)
  Top 0.254: v43.6,67.18 43.6,68.33 44.75,69.47 46.4,69.47 46.91,68.96 IC1.7 | R33.2 32.62,48.7 32.94,49.02
  Top 0.406: R34.2 34.2,51.56 35.35,52.7 v35.35,64.14
  Top 0.61: R29.2 R30.2 R31.2 24.75,37.08 26.59,37.08 27.35,37.85 27.35,40.26 30.27,43.18 32.55,43.18 32.55,45.15 R32.2 | 32.94,44.89 R32.2 | 32.68,45.15 R32.2 | R32.2 R33.2 R34.2
  Bottom 0.254: SW3.1 31.03,70.36 35.6,65.79 39.03,65.79 40.55,67.31 43.48,67.31 v43.6,67.18
  Bottom 0.305: v35.35,64.14 35.6,64.39 35.6,65.79
N$2  (via drill 0.3 pad 0.51)
  Top 0.61: R29.1 v15.79,41.4
  Bottom 0.61: v15.79,41.4 15.16,42.42 SWITCH.1
N$3  (via drill 0.3 pad 0.51)
  Top 0.61: R30.1 v20.23,41.4
  Bottom 0.61: v20.23,41.4 20.23,42.93 18.08,45.09 18.08,49.66 17.44,50.29 SWITCH.2
N$4  (via drill 0.3 pad 0.51)
  Top 0.61: R31.1 v24.68,41.4
  Bottom 0.61: v24.68,41.4 24.68,41.53 21.12,45.09 21.12,49.4 17.7,52.83 SWITCH.3
N$5  (via drill 0.3 pad 0.51)
  Top 0.61: R32.1 v28.24,45.21 SWITCH.4
N$6  (via drill 0.3 pad 0.51)
  Top 0.61: R33.1 v28.24,48.39
  Bottom 0.61: v28.24,48.39 27.6,47.75 SWITCH.5
N$7  (via drill 0.3 pad 0.51)
  Top 0.61: R34.1 v28.24,51.56
  Bottom 0.61: v28.24,51.56 28.24,52.07 27.47,52.83 SWITCH.6
N$8
  Top 0.254: R26.1 53.25,70.29 IC1.2 53.25,65.28 53,65.02 43.48,65.02 42.08,66.42 42.08,68.71 40.55,70.23 34.84,70.23 33.82,69.22 33.82,65.28 30.27,61.72 R27.2
N$9  (via drill 0.3 pad 0.51)
  Top 0.254: R28.2 v51.35,73.15 | 48.17,69.72 v48.17,73.15 | IC1.6 48.17,69.34 48.17,69.72 | v45.51,70.48 47.41,70.48 48.17,69.72
  Bottom 0.254: v51.35,73.15 v48.17,73.15
  Bottom 0.406: SWITCH.C1 23.03,50.29 21.63,51.69 21.63,55.37 22.9,56.64 38.02,56.64 39.41,58.04 39.41,61.72 42.97,65.28 45,65.28 45.38,65.66 45.38,70.36 v45.51,70.48
N$10
  Top 0.254: IC1.1 54.53,67.94 55.54,68.96 55.54,70.55 R26.2 R28.1
N$11  (via drill 0.3 pad 0.51)
  Top 0.254: IC3.2 42.46,84.71 41.32,85.85 R44.1 38.97,87.82 39.03,87.88 v39.03,88.14 | v34.59,80.01 29.76,80.01 26.97,77.22 22.84,77.22 R45.2 R46.2
  Bottom 0.254: v39.03,88.14 39.03,84.45 v34.59,80.01
N$12  (via drill 0.3 pad 0.51)
  Top 0.406: v35.48,93.47 35.48,87.12 R44.2
  Bottom 0.406: P4.2 36.74,96.01 35.48,94.74 v35.48,93.47
N$13  (via drill 0.3 pad 0.51)
  Top 0.254: v46.91,76.96 46.78,76.96 45.76,77.98 41.95,77.98 41.32,77.34 41.32,75.76 IC3.6
  Bottom 0.254: P4.1 v46.91,76.96
  Bottom 0.406: P4.3 44.41,90.97 43.09,89.66 36.92,89.66 33.7,92.89 31.08,92.89 SW3.3
  Bottom 0.61: P4.1 P4.3
N$14  (via drill 0.3 pad 0.51)
  Top 0.61: R45.1 23.09,79.5 v25.31,79.5
  Bottom 0.61: v25.31,79.5 25.23,79.58 J1.3
N$15  (via drill 0.3 pad 0.51)
  Top 0.61: R46.1 18.65,79.5 v16.42,79.5
  Bottom 0.61: v16.42,79.5 15.23,80.69 J1.2
N$16  (via drill 0.3 pad 0.51)
  Top 0.254: R1.2 45.48,56.22 C2.1 49.7,57.4 v50.59,58.29 | C1.2 36.96,39.33 39.28,41.66 39.28,57.91 v41.83,60.45 41.95,60.58
  Bottom 0.254: v41.83,60.45 48.43,60.45 v50.59,58.29
N$17  (via drill 0.3 pad 0.51)
  Top 0.254: IC1.10 49.44,59.18 v48.43,58.17 | v47.79,53.72 48.59,54.52 C2.2 49.57,54.4 49.57,53.34 50.59,52.32 51.6,52.32 52.24,51.69 R2.2
  Bottom 0.254: v48.43,58.17 48.43,54.36 v47.79,53.72
N$18  (via drill 0.3 pad 0.51)
  Top 0.254: R3.2 49.7,51.18 48.81,52.07 45.76,52.07 45.31,52.52 R4.2 46.27,54.1 v46.91,54.74 | v46.91,58.17 48.17,59.44 IC1.9
  Bottom 0.254: v46.91,54.74 v46.91,58.17
N$19
  Top 0.254: R5.1 R4.1 R1.1 43.48,56.7 43.48,58.55 44.49,59.44 46.27,59.44 46.91,59.94 IC1.8
N$20  (via drill 0.3 pad 0.51)
  Top 0.254: R7.2 v54.78,51.31 | v53.64,58.04 53.64,58.8 53.25,59.18 IC1.13 53.25,62.99 53.64,63.5 58.14,63.5 R8.1 58.27,63.25
  Bottom 0.254: v54.78,51.31 53.64,52.83 v53.64,58.04
N$21
  Top 0.254: C3.2 R8.2 | IC1.14 55.09,61.66 55.41,61.34 58.15,61.34 R8.2 | R8.2 63.1,61.41 67.22,65.53 67.22,67.74 D1.A
N$22
  Top 0.254: R6.2 52.34,56.32 C4.2 51.98,56.48 IC1.12
N$23
  Top 0.254: R5.2 46.65,49.78 47.29,49.15 47.29,46.61 48.3,45.59 56.43,45.59 57.95,47.12 57.95,49.53 59.99,51.56 59.99,53.72 59.35,54.36 58.5,54.36 C3.1 | C3.1 58.37,54.48 | C3.1 55.13,54.52 R6.1
N$24  (via drill 0.3 pad 0.51)
  Top 0.254: R9.2 49.53,18.29 C6.1 49.7,19.05 49.95,19.3 50.21,19.3 v50.72,19.81 | C5.2 36.96,25.95 v41.06,21.84
  Bottom 0.254: v41.06,21.84 48.68,21.84 v50.72,19.81
N$25  (via drill 0.3 pad 0.51)
  Top 0.254: R10.2 52.24,13.21 51.73,13.72 50.72,13.72 49.7,14.73 C6.2 48.85,16.42 v47.92,15.49 | IC2.10 49.44,21.08 48.68,20.32 v48.68,19.81
  Bottom 0.254: v48.68,19.81 48.68,16.26 v47.92,15.49
N$26  (via drill 0.3 pad 0.51)
  Top 0.254: R11.2 49.7,13.21 48.68,14.22 45.63,14.22 45.31,14.54 R12.2 46.4,16 v47.16,16.76 | IC2.9 48.17,21.84 47.16,20.83 v47.16,19.81
  Bottom 0.254: v47.16,19.81 v47.16,16.76
N$27
  Top 0.254: IC2.8 46.91,21.84 46.14,21.08 44.62,21.08 43.35,19.81 43.35,18.35 R9.1 R12.1 R13.1
N$28  (via drill 0.3 pad 0.51)
  Top 0.254: R16.1 57.51,25.4 53.76,25.4 53.25,24.89 IC2.13 53.25,22.1 53.76,21.59 v53.76,20.07 | v54.53,13.46 55.03,12.95 R15.2
  Bottom 0.254: v53.76,20.07 53.76,14.22 v54.53,13.46
N$29
  Top 0.254: C7.2 R16.2 | R16.2 57.44,23.56 IC2.14 | R16.2 60.43,23.18 62.14,24.89 62.14,39.09 64.18,41.12 67.45,41.12 D2.A
N$30
  Top 0.254: R14.2 54.93,18.12 C8.2 51.98,18.38 IC2.12
N$31
  Top 0.254: R14.1 57.73,16.32 C7.1 58.42,16.42 59.35,15.49 59.35,12.7 57.83,11.18 57.83,8.89 56.56,7.62 48.43,7.62 47.41,8.64 47.41,10.92 46.65,11.68 R13.2
N$32  (via drill 0.3 pad 0.51)
  Top 0.254: C10.1 50.59,36.2 v52.24,37.85 49.19,37.85 v49.06,37.97 | v56.56,38.23 56.56,36.39 R17.2 | v45,37.97 40.3,37.97 39.79,37.47 39.79,36.2 39.16,35.56 C9.2
  Bottom 0.254: v52.24,37.85 56.18,37.85 v56.56,38.23 | v49.06,37.97 v45,37.97
N$33  (via drill 0.3 pad 0.51)
  Top 0.254: IC2.3 51.98,32 51.48,32.51 50.72,32.51 50.59,32.64 C10.2 50.59,31.37 v50.72,31.24 | v58.46,40.01 58.46,41.85 R18.2
  Bottom 0.254: v50.72,31.24 50.72,37.85 52.62,39.75 58.21,39.75 v58.46,40.01
N$34
  Top 0.254: IC2.2 53.25,31.24 53.64,31.62 R19.2 54.46,33.27 R20.2
N$35  (via drill 0.3 pad 0.51)
  Top 0.254: R17.1 R20.1 58.52,31.43 57.95,30.86 56.62,30.86 IC2.1 v54.53,31.24 | R21.1 47.6,33.98 47.79,33.78 v47.79,32.38
  Bottom 0.254: v47.79,32.38 47.79,31.11 50.08,28.45 52.62,28.45 53.76,29.59 53.76,30.48 v54.53,31.24
N$36  (via drill 0.3 pad 0.51)
  Top 0.254: R24.1 44.75,32.77 45.25,32.26 | 45.25,32.26 46.52,30.99 47.54,30.99 48.17,30.35 IC2.6 | R23.2 41.64,40.7 42.33,40.01 v43.6,40.01 | v45.25,30.35 45.25,32.26
  Bottom 0.254: v45.25,30.35 43.6,32 v43.6,40.01
N$37  (via drill 0.3 pad 0.51)
  Top 0.254: 45.05,28.7 44.37,28.7 41.64,31.43 R24.2 41.64,35.71 C11.2 | IC2.7 46.84,28.7 45.63,28.7 45.05,28.7 | 45.05,28.7 v44.37,28.02 | v61.92,15.04 67.04,15.04 D3.A
  Bottom 0.254: v44.37,28.02 48.81,28.02 49.7,27.13 56.07,27.13 57.45,28.5 59.45,28.5 60.7,27.25 60.7,16.26 v61.92,15.04
N$38
  Top 0.254: R22.2 48.75,42.35 49.32,41.78 49.32,40.89 49.66,40.55 C12.2 | 49.79,40.55 C12.2 | C12.2 50.59,39.5 50.21,39.12 48.43,39.12 47.67,38.35 47.67,37.34 48.81,36.2 48.81,32.77 49.44,32.13 IC2.5
N$39
  Top 0.254: C11.1 43.5,35.88 R21.2 | R21.2 46.91,36 | R21.2 46.65,36 R22.1
N$40  (via drill 0.3 pad 0.51)
  Top 0.406: C1.1 35.26,41.19 36.74,42.67 36.74,66.8 v35.48,68.07
  Top 0.61: C5.1 C9.1 C1.1
  Bottom 0.406: v35.48,68.07 32.94,70.61 32.94,89.66 32.25,90.35 SW3.2
N$41
  Top 0.254: D1.C 67.37,70.78 R35.1
N$42  (via drill 0.3 pad 0.51)
  Top 0.254: R35.2 68.2,77.1 68.7,76.61 68.7,75.62 69.13,75.18 69.92,75.18 C14.1 70.2,75.2 R36.2 73.18,75.69 v77.39,75.69
  Bottom 0.406: v77.39,75.69 IC4.5
N$43
  Top 0.254: D2.C 67.5,49.2 R37.1
N$44  (via drill 0.3 pad 0.51)
  Top 0.254: R37.2 67.9,51.19 68.62,50.47 68.62,49.94 69.26,49.3 R38.2 72.2,49.3 C15.1 78,49.41 v78.02,49.43
  Bottom 0.406: v78.02,49.43 81.35,49.43 81.75,49.02 IC5.5
N$45
  Top 0.254: R39.1 67.08,22.53 D3.C
N$46  (via drill 0.3 pad 0.51)
  Top 0.254: R39.2 67.91,24.66 68.24,24.33 68.24,23.37 68.7,22.91 69.7,22.91 C16.1 69.82,22.8 R40.2 72.85,22.35 v77.39,22.35
  Bottom 0.406: v77.39,22.35 IC6.5
N$47
  Top 0.406: C13.2 28.32,64.1 28.24,64.01 27.73,64.01 26.59,62.87 26.59,61.78 R27.1
N$48
  Bottom 0.254: 83.66,65.61 IC4.9
  Bottom 0.406: SW2A.2 83.66,65.61
N$49  (via drill 0.3 pad 0.51)
  Top 0.254: R41.2 73.16,70.51 v76.17,70.51
  Bottom 0.254: v76.17,70.51 76.27,70.61
  Bottom 0.406: 76.27,70.61 IC4.7 IC4.6
N$50  (via drill 0.3 pad 0.51)
  Top 0.254: R41.1 72.96,68.07 v76.11,68.07
  Top 0.406: v71.03,65.53 72.69,67.19 R41.1
  Bottom 0.406: v76.11,68.07 IC4.8 | P1.2 93.89,96.01 92.62,94.74 92.62,90.93 91.36,89.66 77.39,89.66 74.84,87.12 62.14,87.12 60.88,85.85 60.88,66.8 62.14,65.53 v71.03,65.53
N$51  (via drill 0.3 pad 0.51)
  Top 0.406: v21.51,61.72 22.65,61.72 23.79,62.87 23.79,64.26 24.93,65.41 C13.1 26.62,68.99 R25.1
  Bottom 0.61: MIC.1 20.97,62.26 v21.51,61.72
N$52  (via drill 0.3 pad 0.51)
  Top 0.254: v94.63,84.2 94.53,84.3 94.53,86.49 92.62,88.39 v83.73,88.39
  Bottom 0.254: CON1.1 104.91,81.81 97.02,81.81 v94.63,84.2 | v83.73,88.39 IC4.1
N$53
  Bottom 0.254: IC4.18 105.6,85.85 106.92,84.53 CON1.2
N$54
  Bottom 0.254: IC4.17 93.26,83.31 96.78,79.79 CON1.3
N$55
  Bottom 0.254: IC4.16 93.26,80.77 95.22,78.82 106.09,78.82 106.93,79.66 CON1.4
N$56
  Bottom 0.254: IC4.15 93.26,78.23 93.7,77.79 CON1.5
N$57
  Bottom 0.254: IC4.14 93.26,75.69 94.38,76.81 105.94,76.81 106.92,77.79 CON1.6
N$58
  Bottom 0.254: IC4.13 93.26,73.15 95.9,75.79 CON1.7
N$59
  Bottom 0.254: IC4.12 93.26,70.61 97.45,74.8 106.14,74.8 106.93,75.6 CON1.8
N$60
  Bottom 0.254: IC4.11 93.26,68.07 98.98,73.79 CON1.9
N$61
  Bottom 0.254: IC4.10 93.26,65.53 100.55,72.82 106.27,72.82 106.93,73.49 CON1.10
N$63
  Bottom 0.406: SW2B.2 IC5.9
N$64  (via drill 0.3 pad 0.51)
  Top 0.254: R42.2 78.23,43.52 v78.66,43.94
  Bottom 0.406: v78.66,43.94 IC5.7 IC5.6
N$65  (via drill 0.3 pad 0.51)
  Top 0.254: R42.1 78.23,41.82 v78.66,41.4
  Top 0.406: v71.03,38.86 71.8,38.86 72.66,39.73 72.66,41.74 R42.1
  Bottom 0.406: v78.66,41.4 IC5.8 | P2.2 76.11,96.01 74.84,94.74 74.84,89.66 73.58,88.39 60.88,88.39 59.61,87.12 59.61,59.18 63.42,55.37 63.42,40.13 64.69,38.86 v71.03,38.86
N$66  (via drill 0.3 pad 0.51)
  Top 0.254: v95.17,57.28 95.17,60.45 93.89,61.72 v83.73,61.72
  Bottom 0.254: CON2.1 97.28,55.16 v95.17,57.28 | v83.73,61.72 IC5.1
N$67
  Bottom 0.254: IC5.18 105.02,59.18 107.05,57.15 107.05,55.21 CON2.2
N$68
  Bottom 0.254: 104.98,53.14 CON2.3 96.74,53.16 93.26,56.64 IC5.17
N$69
  Bottom 0.254: IC5.16 93.26,54.1 95.17,52.2 106.59,52.2 107.01,52.61 CON2.4
N$70
  Bottom 0.254: 104.97,51.21 CON2.5 93.66,51.16 93.26,51.56 IC5.15
N$71
  Bottom 0.254: IC5.14 93.26,49.02 94.43,50.19 106.24,50.19 107.01,50.96 CON2.6
N$72
  Bottom 0.254: IC5.13 93.26,46.48 95.94,49.16 CON2.7
N$73
  Bottom 0.254: IC5.12 93.26,43.94 97.5,48.18 106.57,48.18 107.01,48.62 CON2.8
N$74
  Bottom 0.254: IC5.11 93.26,41.4 99.02,47.16 CON2.9
N$75
  Bottom 0.254: IC5.10 93.26,38.86 100.58,46.18 106.27,46.18 107.01,46.92 CON2.10
N$77
  Bottom 0.254: 83.69,12.23 IC6.9
  Bottom 0.406: SW2C.2 83.69,12.23
N$78  (via drill 0.3 pad 0.51)
  Top 0.254: R43.2 77.23,17.12 v77.39,17.27
  Bottom 0.406: v77.39,17.27 IC6.7 IC6.6
N$79  (via drill 0.3 pad 0.51)
  Top 0.254: v77.39,14.73 76.69,15.42 R43.1 72.58,12.46 v72.31,12.19
  Bottom 0.406: v77.39,14.73 IC6.8 | v72.31,12.19 69.77,12.19 63.42,18.54 63.42,30.28 61.99,31.7 61.99,54.25 58.33,57.91 58.33,87.12 57.06,88.39 57.06,94.74 58.33,96.01 P3.2
N$80  (via drill 0.3 pad 0.51)
  Top 0.254: v95.52,30.89 95.52,34.14 94.5,35.15 84.04,35.15 v83.73,34.85
  Bottom 0.254: CON3.1 96.84,28.5 95.52,29.82 v95.52,30.89 | v83.73,34.85 IC6.1
N$81
  Bottom 0.254: IC6.18 104.06,32.51 107.01,29.56 CON3.2
N$82
  Bottom 0.254: IC6.17 93.26,29.97 96.74,26.5 CON3.3
N$83
  Bottom 0.254: IC6.16 93.26,27.43 95.17,25.53 106.21,25.53 107.01,26.32 CON3.4
N$84
  Bottom 0.254: IC6.15 94.53,24.89 94.93,24.5 CON3.5
N$85
  Bottom 0.254: IC6.14 93.26,22.35 94.4,23.5 106.21,23.5 107.01,24.29 CON3.6
N$86
  Bottom 0.254: IC6.13 93.26,19.81 95.94,22.5 CON3.7
N$87
  Bottom 0.254: IC6.12 93.26,17.27 97.53,21.54 106.34,21.54 107.01,22.21 CON3.8
N$88
  Bottom 0.254: IC6.11 93.26,14.73 99.02,20.5 CON3.9
N$89
  Bottom 0.254: IC6.10 93.26,12.19 100.58,19.51 106.19,19.51 107.01,20.33 CON3.10

### Text on the board
tNames: HIGH | MID | LOW | Sens. / Aux | LOW | MID | + | 0 | DUAL | - | VLED | HIGH | Design by: / Santiago Junquera Carrero / Fco Javier García Pedroche